# Altium schematic sheet 12V_Converter.SchDoc
size A
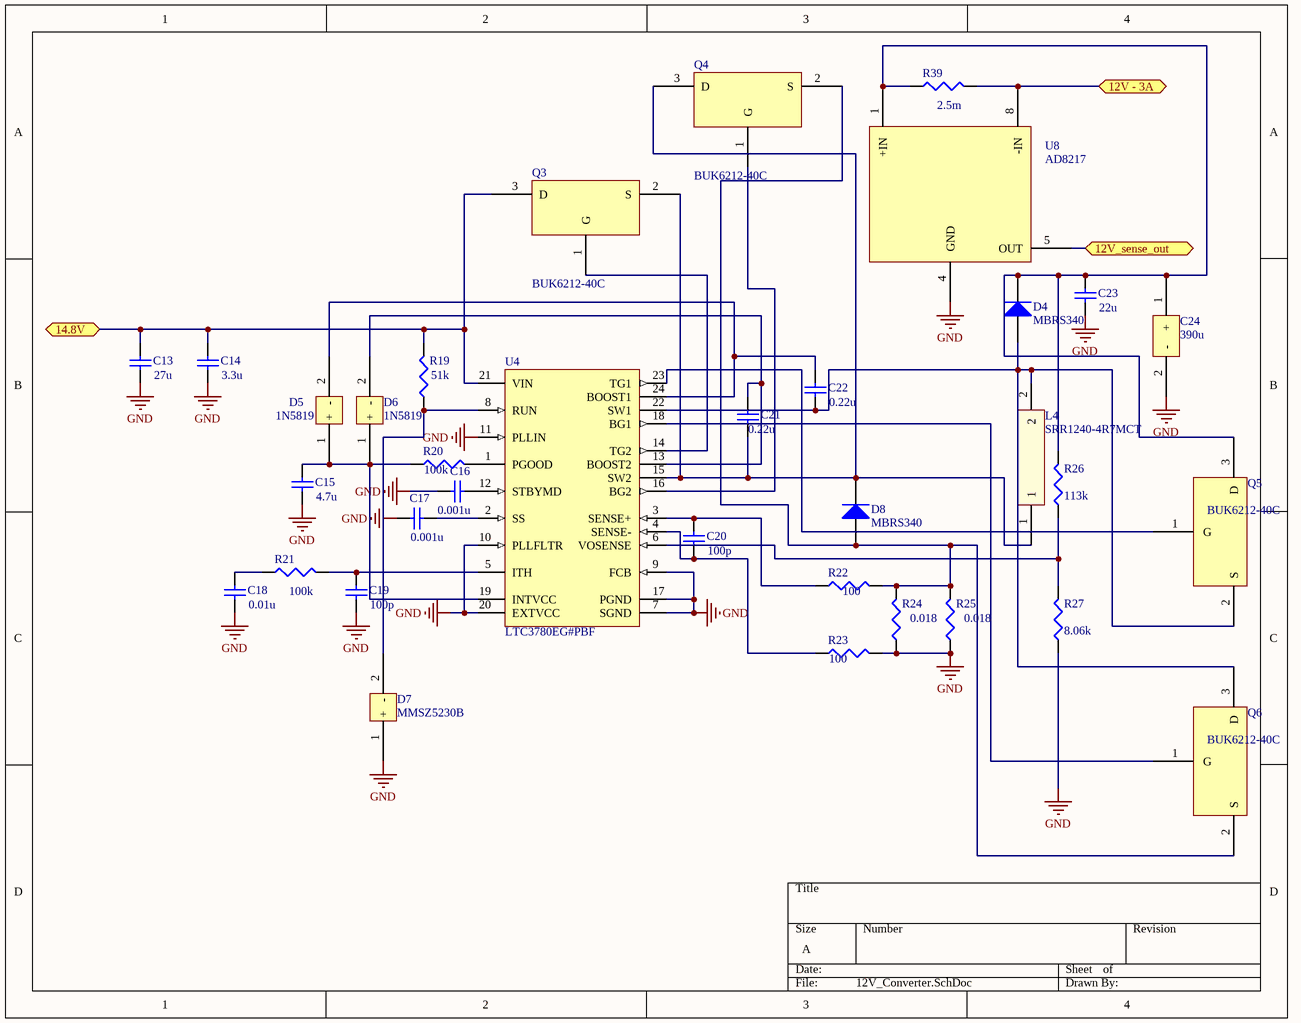
[diagram p0: 12V_Converter.SchDoc]

## Parts
C13  value 27u  [C1206]  (hidden comment: Cap Semi)
C14  value 3.3u  [C1206]  (hidden comment: Cap Semi)
C15  value 4.7u  [C1206]  (hidden comment: Cap Semi)
C16  value 0.001u  [C1206]  (hidden comment: Cap Semi)
C17  value 0.001u  [C1206]  (hidden comment: Cap Semi)
C18  value 0.01u  [C1206]  (hidden comment: Cap Semi)
C19  value 100p  [C1206]  (hidden comment: Cap Semi)
C20  value 100p  [C1206]  (hidden comment: Cap Semi)
C21  value 0.22u  [C1206]  (hidden comment: Cap Semi)
C22  value 0.22u  [C1206]  (hidden comment: Cap Semi)
C23  value 22u  [C1206]  (hidden comment: Cap Semi)
C24  390u  [Alum_Cap]
D4  MBRS340  [SMC]
D5  1N5819  [SOD-123]
D6  1N5819  [SOD-123]
D7  MMSZ5230B  [SOD-123]
D8  MBRS340  [SMC]
L4  SRR1240-4R7MCT  [INDP125125X45N]
Q3  BUK6212-40C  [SOT457P1000X238-3N]
Q4  BUK6212-40C  [SOT457P1000X238-3N]
Q5  BUK6212-40C  [SOT457P1000X238-3N]
Q6  BUK6212-40C  [SOT457P1000X238-3N]
R19  value 51k  [J1-0603]  (hidden comment: Res3)
R20  value 100k  [J1-0603]  (hidden comment: Res3)
R21  value 100k  [J1-0603]  (hidden comment: Res3)
R22  value 100  [J1-0603]  (hidden comment: Res3)
R23  value 100  [J1-0603]  (hidden comment: Res3)
R24  value 0.018  [J1-0603]  (hidden comment: Res3)
R25  value 0.018  [J1-0603]  (hidden comment: Res3)
R26  value 113k  [J1-0603]  (hidden comment: Res3)
R27  value 8.06k  [J1-0603]  (hidden comment: Res3)
R39  value 2.5m  [J1-0603]  (hidden comment: Res3)
U4  LTC3780EG#PBF  [LT-G-24_N]
U8  AD8217  [TSOP65P490X110-8N]

## Ports
12V - 3A, 12V_sense_out, 14.8V

## Nets
GND: C13.1 C14.1 C15.1 C16.1 C17.1 C18.1 C19.1 C23.1 C24.2(-) D7.1(+) R23.2 R24.1 R25.1 R27.1 U4.7(SGND) U4.9(FCB) U4.10(PLLFLTR) U4.11(PLLIN) U4.17(PGND) U4.20(EXTVCC) U8.4(GND)
12V - 3A: R39.2 U8.8(-IN) ; port 12V - 3A
12V_sense_out: U8.5(OUT) ; port 12V_sense_out
14.8V: C13.2 C14.2 Q3.3(D) R19.2 U4.21(VIN) ; port 14.8V
NetC15_2: C15.2 D5.1(+) D6.1(+) R20.1 U4.19(INTVCC)
NetC16_2: C16.2 U4.12(STBYMD)
NetC17_2: C17.2 U4.2(SS)
NetC18_2: C18.2 R21.1
NetC19_2: C19.2 R21.2 U4.5(ITH)
NetC20_1: C20.1 R23.1 U4.4(SENSE-)
NetC20_2: C20.2 R22.1 U4.3(SENSE+)
NetC21_1: C21.1 D8.2(K) L4.1 Q3.2(S) Q4.3(D) U4.15(SW2)
NetC21_2: C21.2 D6.2(-) U4.13(BOOST2)
NetC22_1: C22.1 D4.1(A) L4.2 Q5.2(S) Q6.3(D) U4.22(SW1)
NetC22_2: C22.2 D5.2(-) U4.24(BOOST1)
NetC23_2: C23.2 C24.1(+) D4.2(K) Q5.3(D) R26.2 R39.1 U8.1(+IN)
NetD7_2: D7.2(-) R19.1 U4.8(RUN)
NetD8_1: D8.1(A) Q4.2(S) Q6.2(S) R22.2 R24.2 R25.2
NetQ3_1: Q3.1(G) U4.14(TG2)
NetQ4_1: Q4.1(G) U4.16(BG2)
NetQ5_1: Q5.1(G) U4.23(TG1)
NetQ6_1: Q6.1(G) U4.18(BG1)
NetR20_2: R20.2 U4.1(PGOOD)
NetR26_1: R26.1 R27.2 U4.6(VOSENSE)

## Library data of the parts
C13-C23 = Cap Semi: Capacitor (Semiconductor SIM Model); Published: 8-Jun-2000; LatestRevisionDate: 29-May-2009; LatestRevisionNote: IPC-7351 Footprint Added.; PackageReference: C1206; Publisher: Altium Limited; PackageDescription: Chip Capacitor
C24 = Alum_Cap
D4 D8 = Diode: Default Diode; Published: 8-Jun-2000; LatestRevisionDate: 17-Jul-2002; LatestRevisionNote: Re-released for DXP Platform.; PackageVersion: Sep-1996; PackageReference: SMC; Publisher: Altium Limited; PackageDescription: DO-214-AB/SMC; 2 C-Bend Leads; Body 7.9 x 5.9 mm, inc. leads (LxW); Code_JEDEC: DO-214-AB
D5-D7 Q3-Q6 = Component_1
R19-R27 R39 = Res3: Resistor; Published: 8-Jun-2000; LatestRevisionDate: 29-May-2009; LatestRevisionNote: IPC-7351 Footprint Added.; PackageReference: J1-0603; Publisher: Altium Limited; PackageDescription: Chip Resistor
U4 = LTC3780EG#PBF: Buck-boost Controller, Constant Frequency, Current Mode Control with Power Good Output, 24-pin SOP (G-24), -40 to 85 degC, Pb-Free; Manufacturer: Linear Technology; Frequency Sync Range: 200kHz - 400kHz; Number of Outputs: 1; DatasheetVersion: Rev. F; PackageVersion: Jun-10; PackageReference: G-24; PackageDescription: 24-Pin Plastic SSOP, Body 8.2 x 5.3 mm, Pitch 0.65 mm; Supplier 1: Digi-Key; Supplier Part Number 1: LTC3780EG#PBF-ND; Supplier 2: Farnell; Supplier Part Number 2: 1273545; Supplier 3: Newark; Supplier Part Number 3: 56M8395; RoHS: TRUE; Mounting Technology: Surface Mount; PartNumber: LTC3780EG#PBF; ComponentLink1Description: Manufacturer URL; ComponentLink1URL: http://www.linear.com/; ComponentLink2Description: Datasheet; ComponentLink2URL: http://cds.linear.com/docs/en/datasheet/3780ff.pdf; ComponentLink3Description: Package Specification; ComponentLink3URL: http://cds.linear.com/docs/en/packaging/SSOP_24_05-08-1640.pdf
U8 = Component_1: Current Shunt Moniter